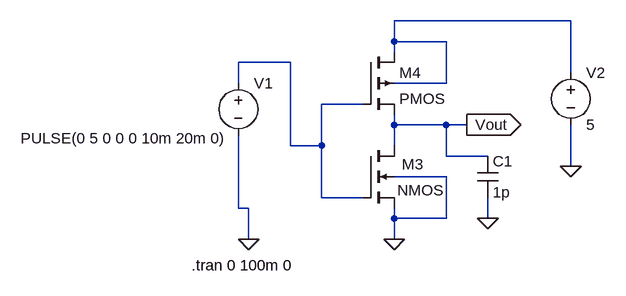
[diagram p0: schematic CMOS inverter design.asc]
CMOS inverter design.asc, the LTspice schematic file:
Version 4.1
SHEET 1 880 680
WIRE 480 64 208 64
WIRE 208 96 208 64
WIRE 288 96 208 96
WIRE 208 112 208 96
WIRE 48 128 -32 128
WIRE 480 144 480 64
WIRE -32 160 -32 128
WIRE 288 160 288 96
WIRE 288 160 208 160
WIRE 160 192 96 192
WIRE 208 224 208 208
WIRE 288 224 208 224
WIRE 320 224 288 224
WIRE 48 256 48 128
WIRE 96 256 96 192
WIRE 96 256 48 256
WIRE 208 256 208 224
WIRE 288 272 288 224
WIRE 352 272 288 272
WIRE 480 288 480 224
WIRE 288 304 208 304
WIRE 96 336 96 256
WIRE 160 336 96 336
WIRE -32 352 -32 240
WIRE -16 352 -32 352
WIRE 208 368 208 352
WIRE 288 368 288 304
WIRE 288 368 208 368
WIRE 352 368 352 336
WIRE -16 400 -16 352
WIRE 208 400 208 368
FLAG -16 400 0
FLAG 208 400 0
FLAG 480 288 0
FLAG 320 224 Vout
IOPIN 320 224 Out
FLAG 352 368 0
SYMBOL voltage -32 144 R0
WINDOW 3 -335 101 Left 2
WINDOW 123 0 0 Left 0
WINDOW 39 0 0 Left 0
SYMATTR InstName V1
SYMATTR Value PULSE(0 5 0 0 0 10m 20m 0)
SYMBOL voltage 480 128 R0
WINDOW 123 0 0 Left 0
WINDOW 39 0 0 Left 0
SYMATTR InstName V2
SYMATTR Value 5
SYMBOL nmos4 160 256 R0
WINDOW 0 60 29 Left 2
WINDOW 3 53 69 Left 2
SYMATTR InstName M3
SYMBOL pmos4 160 112 R0
SYMATTR InstName M4
SYMBOL cap 336 272 R0
SYMATTR InstName C1
SYMATTR Value 1p
TEXT -104 440 Left 2 !.tran 0 100m 0

The netlist it stands for:
* CMOS inverter design.asc
V1 N002 0 PULSE(0 5 0 0 0 10m 20m 0)
V2 N001 0 5
M3 Vout N002 0 0 NMOS
M4 N001 N002 Vout N001 PMOS
C1 Vout 0 1p
.model NMOS NMOS
.model PMOS PMOS
.lib standard.mos
.tran 0 100m 0
.backanno
.end